# Altium schematic sheet 03_RPI_VIDEO.SchDoc
size A4; Revision: A
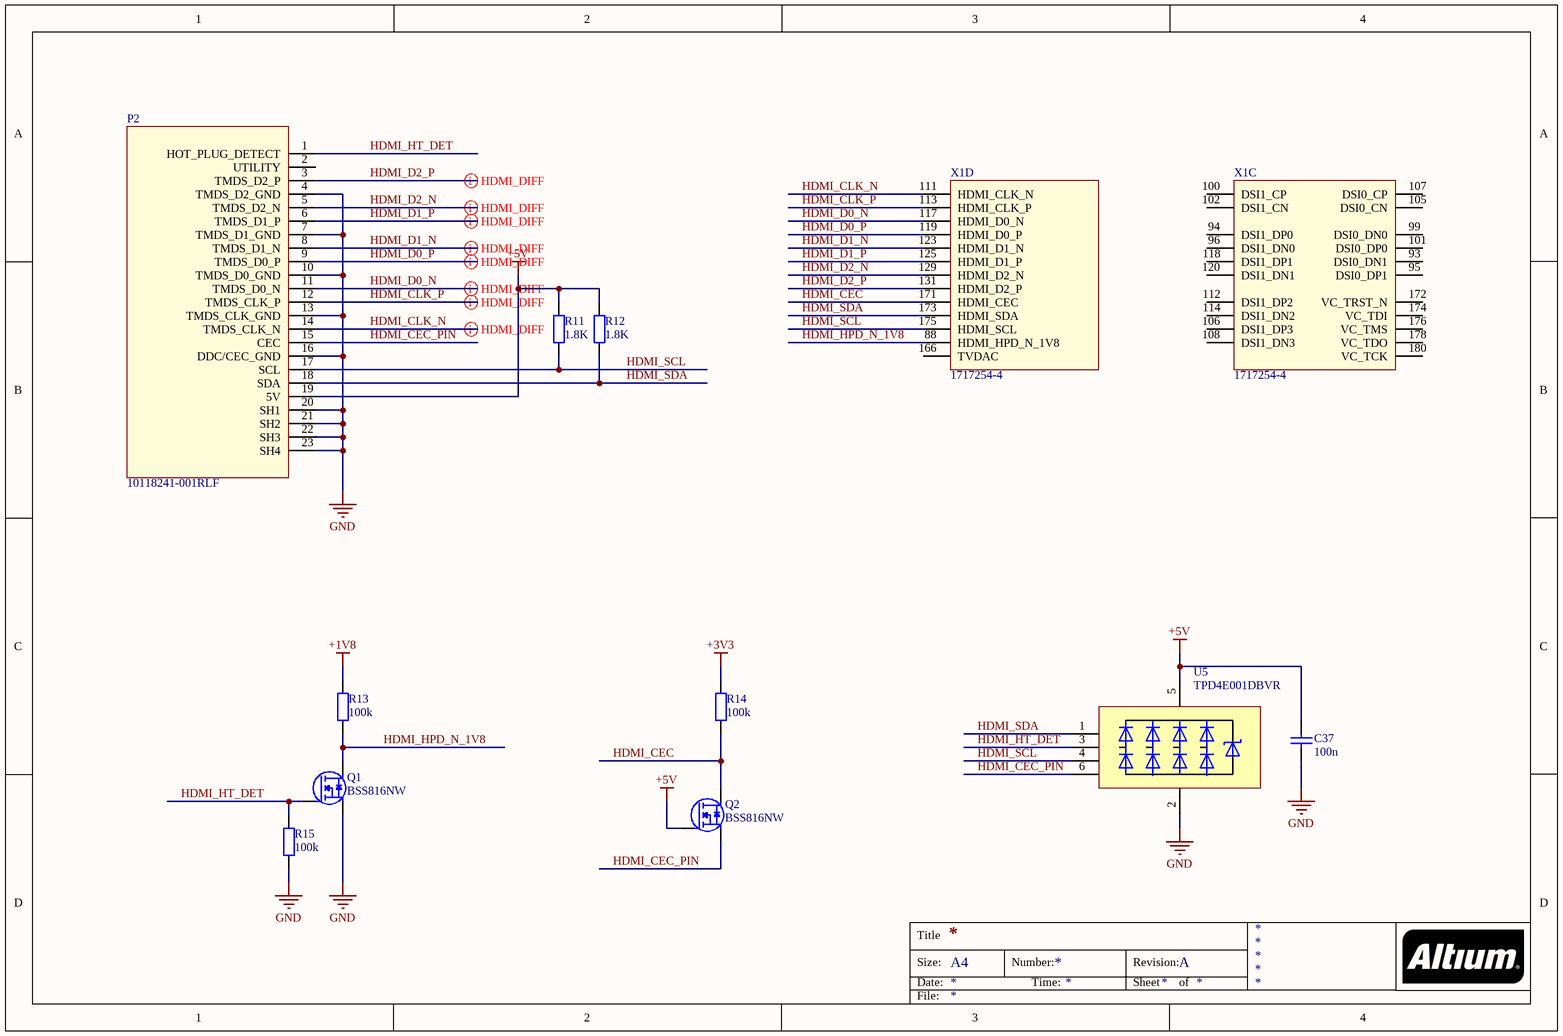
[diagram p0: 03_RPI_VIDEO.SchDoc]

## Parts
C37  100n  [C0603_IPC_HD]
P2  10118241-001RLF  [10118241-001RLF]
Q1  BSS816NW  [SOT323]
Q2  BSS816NW  [SOT323]
R11  1.8K  [R0603_IPC_MD]
R12  1.8K  [R0603_IPC_MD]
R13  100k  [R0603_IPC_MD]
R14  100k  [R0603_IPC_MD]
R15  100k  [R0603_IPC_MD]
U5  TPD4E001DBVR  [SOT23-6]
X1  1717254-4  [1717254-1]  (parts C,D of 7)

## Nets
+1V8: R13.2
+3V3: R14.2
+5V: C37.2 P2.19(5V) Q2.1(G) R11.2 R12.2 U5.5(VCC)
GND: C37.1 P2.4(TMDS_D2_GND) P2.7(TMDS_D1_GND) P2.10(TMDS_D0_GND) P2.13(TMDS_CLK_GND) P2.16(DDC/CEC_GND) P2.20(SH1) P2.21(SH2) P2.22(SH3) P2.23(SH4) Q1.2(S) R15.1 U5.2(GND)
HDMI_CEC: Q2.3(D) R14.1 X1.171(HDMI_CEC)
HDMI_CEC_PIN: P2.15(CEC) Q2.2(S) U5.6(IO4)
HDMI_CLK_N: P2.14(TMDS_CLK_N) X1.111(HDMI_CLK_N)
HDMI_CLK_P: P2.12(TMDS_CLK_P) X1.113(HDMI_CLK_P)
HDMI_D0_N: P2.11(TMDS_D0_N) X1.117(HDMI_D0_N)
HDMI_D0_P: P2.9(TMDS_D0_P) X1.119(HDMI_D0_P)
HDMI_D1_N: P2.8(TMDS_D1_N) X1.123(HDMI_D1_N)
HDMI_D1_P: P2.6(TMDS_D1_P) X1.125(HDMI_D1_P)
HDMI_D2_N: P2.5(TMDS_D2_N) X1.129(HDMI_D2_N)
HDMI_D2_P: P2.3(TMDS_D2_P) X1.131(HDMI_D2_P)
HDMI_HPD_N_1V8: Q1.3(D) R13.1 X1.88(HDMI_HPD_N_1V8)
HDMI_HT_DET: P2.1(HOT_PLUG_DETECT) Q1.1(G) R15.2 U5.3(IO2)
HDMI_SCL: P2.17(SCL) R11.1 U5.4(IO3) X1.175(HDMI_SCL)
HDMI_SDA: P2.18(SDA) R12.1 U5.1(IO1) X1.173(HDMI_SDA)

Not connected (* = marked no-connect by the designer): P2 2(UTILITY); X1 93(DSI0_DN1) 94(DSI1_DP0) 95(DSI0_DP1) 96(DSI1_DN0) 99(DSI0_DN0) 100(DSI1_CP) 101(DSI0_DP0) 102(DSI1_CN) 105(DSI0_CN) 106(DSI1_DP3) 107(DSI0_CP) 108(DSI1_DN3) 112(DSI1_DP2) 114(DSI1_DN2) 118(DSI1_DP1) 120(DSI1_DN1) 166(TVDAC) 172(VC_TRST_N) 174(VC_TDI) 176(VC_TMS) 178(VC_TDO) 180(VC_TCK)

## Layout directives
differential pair: HDMI_CLK_N, HDMI_CLK_P, HDMI_D0_N, HDMI_D0_P, HDMI_D1_N, HDMI_D1_P, HDMI_D2_N, HDMI_D2_P

## Notes on the sheet
- Title
- Size:
- Date:
- A4
- Number:
- Time:
- Revision:
- Sheet
- of
- File:

## Library data of the parts
C37 = CL10B104KO8NNNC: CAP CER 0.1UF 16V X7R 0603; Manufacturer: Samsung Electro-Mechanics; Manufacturer Part Number: CL10B104KO8NNNC; Voltage: 16V; Value: 100n; Dielectric: X7R; Supplier 1: Digi-Key; Supplier Part Number 1: 1276-1005-1-ND
P2 = 10118241-001RLF: CONN RCP MICRO HDMI 19POS SMD RA; Manufacturer: Amphenol ICC (FCI); Manufacturer Part Number: 10118241-001RLF; Supplier 1: Digi-Key; Supplier Part Number 1: 609-4615-1-ND
Q1 Q2 = BSS816: N-Channel Logic Level Enhancement Mode Field Effect Transistor; Manufacturer: Infineon Technologies; Manufacturer Part Number: BSS816NW; Supplier 1: Digi-Key; Supplier Part Number 1: BSS816NWH6327XTSA1CT-ND
R11 R12 = CR0603-JW-182ELF: RES SMD 1.8K OHM 5% 1/10W 0603; Manufacturer: Bourns Inc.; Value: 1.8K; Tolarance: 5%; Manufacturer Part Number: CR0603-JW-182ELF; Supplier 1: Digi-Key; Supplier Part Number 1: CR0603-JW-182ELFCT-ND
R13-R15 = RMCF0603FT100K: RES 100K OHM 1% 1/10W 0603; Manufacturer: Bourns Inc.; Value: 100k; Tolarance: 1%; Manufacturer Part Number: RMCF0603FT100K; Supplier 1: Digi-Key; Supplier Part Number 1: RMCF0603FT100KCT-ND
U5 = TPD4E001DBVR: 4x TVS DIODE 5.5V SOT23-6; Manufacturer: TI; Manufacturer Part Number: TPD4E001DBVR; Supplier 1: Digi-Key; Supplier Part Number 1: 296-28203-1-ND
X1 = Raspberry CM Connector: CONN SKT SODIMM 200POS R/A SMD; Manufacturer: TE Connectivity AMP Connectors; Manufacturer Part Number: 1717254-4; Supplier 1: Digi-Key; Supplier Part Number 1: A130932CT-ND